# Altium schematic sheet TelecarRemoteControlStc8051.SchDoc
size 190 x 120 mm
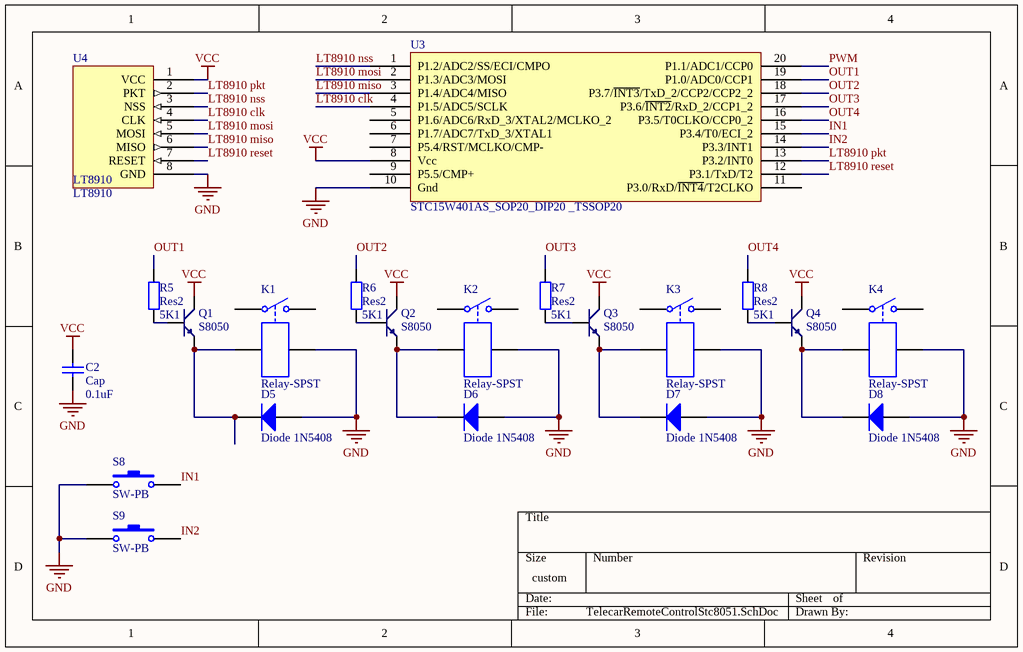
[diagram p0: TelecarRemoteControlStc8051.SchDoc]

## Parts
C2  Cap  value 0.1uF  [RAD-0.3]
D5  Diode 1N5408  [DIO18.84-9.6x5.6]
D6  Diode 1N5408  [DIO18.84-9.6x5.6]
D7  Diode 1N5408  [DIO18.84-9.6x5.6]
D8  Diode 1N5408  [DIO18.84-9.6x5.6]
K1  Relay-SPST  [DIP-P4]
K2  Relay-SPST  [DIP-P4]
K3  Relay-SPST  [DIP-P4]
K4  Relay-SPST  [DIP-P4]
Q1  S8050  [SOT-23R]
Q2  S8050  [SOT-23R]
Q3  S8050  [SOT-23R]
Q4  S8050  [SOT-23R]
R5  Res2  value 5K1  [AXIAL-0.4]
R6  Res2  value 5K1  [AXIAL-0.4]
R7  Res2  value 5K1  [AXIAL-0.4]
R8  Res2  value 5K1  [AXIAL-0.4]
S8  SW-PB  [SPST-2]
S9  SW-PB  [SPST-2]
U3  STC15W401AS_SOP20_DIP20 _TSSOP20  [TSSOP20]
U4  LT8910

## Nets
GND: C2.1 D5.1(A) D6.1(A) D7.1(A) D8.1(A) K1.4 K2.4 K3.4 K4.4 S8.1 S9.1 U3.10(Gnd) U4.8(GND)
VCC: C2.2 Q1.3(C) Q2.3(C) Q3.3(C) Q4.3(C) U3.8(Vcc) U4.1(VCC)
IN1: S8.2 U3.15(P3.4/T0/ECI_2)
IN2: S9.2 U3.14(P3.3/INT1)
LT8910 clk: U3.4(P1.5/ADC5/SCLK) U4.4(CLK)
LT8910 miso: U3.3(P1.4/ADC4/MISO) U4.6(MISO)
LT8910 mosi: U3.2(P1.3/ADC3/MOSI) U4.5(MOSI)
LT8910 nss: U3.1(P1.2/ADC2/SS/ECI/CMPO) U4.3(NSS)
LT8910 pkt: U3.13(P3.2/INT0) U4.2(PKT)
LT8910 reset: U3.12(P3.1/TxD/T2) U4.7(RESET)
OUT1: R5.2 U3.19(P1.0/ADC0/CCP1)
OUT2: R6.2 U3.18(P3.7/~{INT3}/TxD_2/CCP2/CCP2_2)
OUT3: R7.2 U3.17(P3.6/~{INT2}/RxD_2/CCP1_2)
OUT4: R8.2 U3.16(P3.5/T0CLKO/CCP0_2)
PWM: U3.20(P1.1/ADC1/CCP0)
NetD5_2: D5.2(K) K1.3 Q1.1(E)
NetD6_2: D6.2(K) K2.3 Q2.1(E)
NetD7_2: D7.2(K) K3.3 Q3.1(E)
NetD8_2: D8.2(K) K4.3 Q4.1(E)
NetQ1_2: Q1.2(B) R5.1
NetQ2_2: Q2.2(B) R6.1
NetQ3_2: Q3.2(B) R7.1
NetQ4_2: Q4.2(B) R8.1

Not connected (* = marked no-connect by the designer): K1 1 2; K2 1 2; K3 1 2; K4 1 2; U3 5(P1.6/ADC6/RxD_3/XTAL2/MCLKO_2) 6(P1.7/ADC7/TxD_3/XTAL1) 7(P5.4/RST/MCLKO/CMP-) 9(P5.5/CMP+) 11(P3.0/RxD/~{INT4}/T2CLKO)

## Library data of the parts
C2 = Cap: Capacitor; Published: 8-Jun-2000; LatestRevisionDate: 17-Jul-2002; LatestRevisionNote: Re-released for DXP Platform.; PackageReference: RAD-0.3; Publisher: Altium Limited
D5-D8 = Diode 1N5408: 3 Amp Medium Power Silicon Rectifier Diode; Published: 8-Jun-2000; LatestRevisionDate: 17-Jul-2002; LatestRevisionNote: Re-released for DXP Platform.; DatasheetVersion: Aug-1984; PackageReference: DO-201AD; Publisher: Altium Limited; ComponentLink1Description: Manufacturer Link; ComponentLink1URL: http://www.irf.com/
K1-K4 = Relay-SPST: Single-Pole Single-Throw Relay; Published: 24-Mar-1999; LatestRevisionDate: 17-Jul-2002; LatestRevisionNote: Re-released for DXP Platform.; PackageReference: MODULE4; Publisher: Altium Limited
Q1-Q4 = NPN: 8050/BCW846/BCW847
R5-R8 = Res2: Resistor; Published: 8-Jun-2000; LatestRevisionDate: 17-Jul-2002; LatestRevisionNote: Re-released for DXP Platform.; PackageReference: AXIAL-0.4; Publisher: Altium Limited
S8 S9 = SW-PB: Switch; Published: 24-Mar-1999; LatestRevisionDate: 17-Jul-2002; LatestRevisionNote: Re-released for DXP Platform.; PackageReference: SPST-2; Publisher: Altium Limited